# Altium schematic sheet Micro.SchDoc: Microcontrolador MSP430F2618
size A4; Address1: Medidor de energia PROSER; Address2: MEI-300V; DocumentNumber: 2; Revision: 01; SheetNumber: 2; SheetTotal: 6
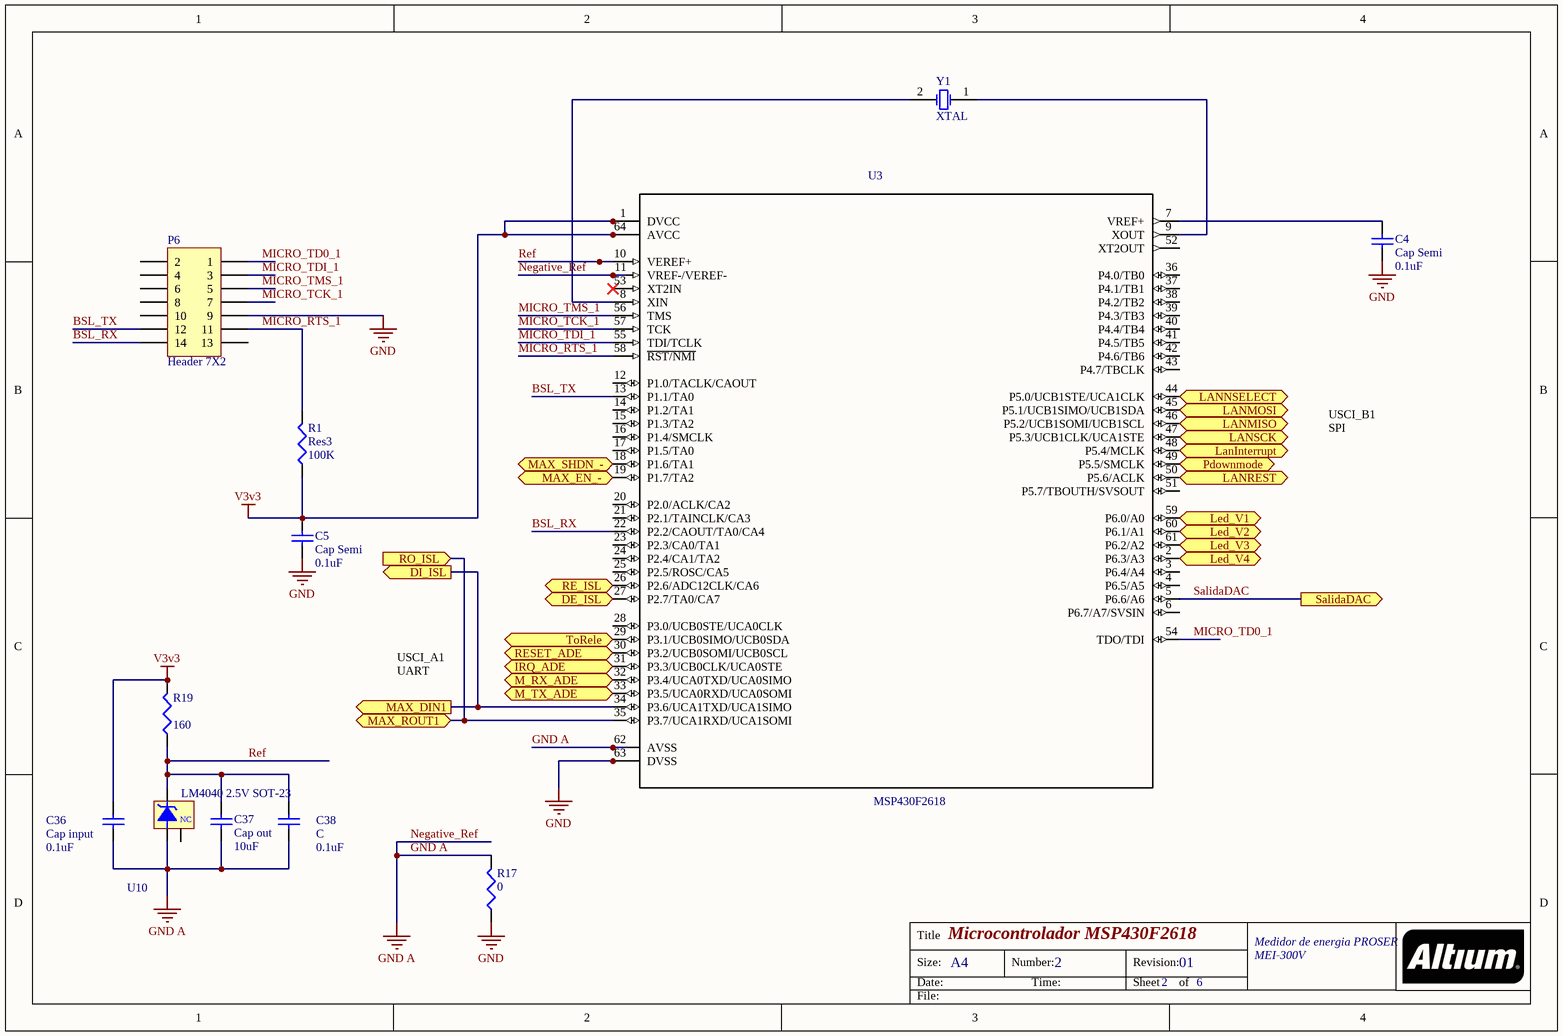
[diagram p0: Micro.SchDoc]

## Parts
C4  Cap Semi  value 0.1uF  [Custom0805]
C5  Cap Semi  value 0.1uF  [Custom0805]
C36  Cap input  value 0.1uF  [CUSTOM0805]
C37  Cap out  value 10uF  [TC6032-2412]
C38  C  value 0.1uF  [Custom0805]
P6  Header 7X2  [HDR2X7]
R1  Res3  value 100K  [Custom0805]
R17  value 0  [Custom0805]  (hidden comment: Res3)
R19  value 160  [Custom0805]  (hidden comment: Res3)
U3  MSP430F2618  [QFP50P1200X1200X160-64N]
U10  LM4040 2.5V SOT-23  [SOT23_M]
Y1  XTAL  [XTAL1140X475X430D1315L440X63M]

## Ports
DE_ISL (out), DI_ISL (out), IRQ_ADE (in), LanInterrupt (in), LANMISO (in), LANMOSI (out), LANNSELECT (out), LANREST (out), LANSCK (out), Led_V1 (out), Led_V2 (out), Led_V3 (out), Led_V4 (out), M_RX_ADE (out), M_TX_ADE (in), MAX_DIN1 (out), MAX_EN_- (out), MAX_ROUT1, MAX_SHDN_- (out), Pdownmode (out), RE_ISL (out), RESET_ADE (out), RO_ISL (in), SalidaDAC (out), ToRele (out)

## Nets
GND: C4.1 C5.1 P6.9 R17.1 U3.63(DVSS)
GND A: C36.1 C37.1 C38.1 R17.2 U3.11(VREF-/VEREF-) U3.62(AVSS) U10.2(A)  [also labelled Negative_Ref]
V3v3: C5.2 C36.2 R1.1 R19.2 U3.1(DVCC) U3.64(AVCC)
BSL_RX: P6.14 U3.22(P2.2/CAOUT/TA0/CA4)
BSL_TX: P6.12 U3.13(P1.1/TA0)
DE_ISL: U3.27(P2.7/TA0/CA7) ; port DE_ISL
DI_ISL: U3.34(P3.6/UCA1TXD/UCA1SIMO) ; port DI_ISL, port MAX_DIN1
IRQ_ADE: U3.31(P3.3/UCB0CLK/UCA0STE) ; port IRQ_ADE
LanInterrupt: U3.48(P5.4/MCLK) ; port LanInterrupt
LANMISO: U3.46(P5.2/UCB1SOMI/UCB1SCL) ; port LANMISO
LANMOSI: U3.45(P5.1/UCB1SIMO/UCB1SDA) ; port LANMOSI
LANNSELECT: U3.44(P5.0/UCB1STE/UCA1CLK) ; port LANNSELECT
LANREST: U3.50(P5.6/ACLK) ; port LANREST
LANSCK: U3.47(P5.3/UCB1CLK/UCA1STE) ; port LANSCK
Led_V1: U3.59(P6.0/A0) ; port Led_V1
Led_V2: U3.60(P6.1/A1) ; port Led_V2
Led_V3: U3.61(P6.2/A2) ; port Led_V3
Led_V4: U3.2(P6.3/A3) ; port Led_V4
M_RX_ADE: U3.32(P3.4/UCA0TXD/UCA0SIMO) ; port M_RX_ADE
M_TX_ADE: U3.33(P3.5/UCA0RXD/UCA0SOMI) ; port M_TX_ADE
MAX_EN_-: U3.19(P1.7/TA2) ; port MAX_EN_-
MAX_ROUT1: U3.35(P3.7/UCA1RXD/UCA1SOMI) ; port RO_ISL, port MAX_ROUT1
MAX_SHDN_-: U3.18(P1.6/TA1) ; port MAX_SHDN_-
MICRO_RTS_1: P6.11 R1.2 U3.58(~{RST/NMI})
MICRO_TCK_1: P6.7 U3.57(TCK)
MICRO_TD0_1: P6.1 U3.54(TDO/TDI)
MICRO_TDI_1: P6.3 U3.55(TDI/TCLK)
MICRO_TMS_1: P6.5 U3.56(TMS)
Pdownmode: U3.49(P5.5/SMCLK) ; port Pdownmode
RE_ISL: U3.26(P2.6/ADC12CLK/CA6) ; port RE_ISL
Ref: C37.2 C38.2 R19.1 U3.10(VEREF+) U10.1(K)
RESET_ADE: U3.30(P3.2/UCB0SOMI/UCB0SCL) ; port RESET_ADE
SalidaDAC: U3.5(P6.6/A6) ; port SalidaDAC
ToRele: U3.29(P3.1/UCB0SIMO/UCB0SDA) ; port ToRele
NetC4_2: C4.2 U3.7(VREF+)
NetU3_8: U3.8(XIN) Y1.2(OSC2)
NetU3_9: U3.9(XOUT) Y1.1(OSC1)

Not connected (* = marked no-connect by the designer): P6 2 4 6 8 10 13; U3 3(P6.4/A4) 4(P6.5/A5) 6(P6.7/A7/SVSIN) 12(P1.0/TACLK/CAOUT) 14(P1.2/TA1) 15(P1.3/TA2) 16(P1.4/SMCLK) 17(P1.5/TA0) 20(P2.0/ACLK/CA2) 21(P2.1/TAINCLK/CA3) 23(P2.3/CA0/TA1) 24(P2.4/CA1/TA2) 25(P2.5/ROSC/CA5) 28(P3.0/UCB0STE/UCA0CLK) 36(P4.0/TB0) 37(P4.1/TB1) 38(P4.2/TB2) 39(P4.3/TB3) 40(P4.4/TB4) 41(P4.5/TB5) 42(P4.6/TB6) 43(P4.7/TBCLK) 51(P5.7/TBOUTH/SVSOUT) 52(XT2OUT) 53(XT2IN)*; U10 3(NC)

## Notes on the sheet
- USCI_B1
  SPI
- USCI_A1
  UART
- Title
- Size:
- Date:
- A4
- Number:
- Time:
- Revision:
- Sheet
- of
- File:

## Library data of the parts
C4 C5 C36-C38 = Cap Semi: Capacitor (Semiconductor SIM Model); Published: 8-Jun-2000; LatestRevisionDate: 29-May-2009; LatestRevisionNote: IPC-7351 Footprint Added.; PackageReference: C1206; Publisher: Altium Limited; PackageDescription: Chip Capacitor
P6 = Header 7X2: Header, 7-Pin, Dual row; LatestRevisionDate: 17-Jul-2002; LatestRevisionNote: Re-released for DXP Platform.; Publisher: Altium Limited
R1 R17 R19 = Res3: Resistor; Published: 8-Jun-2000; LatestRevisionDate: 29-May-2009; LatestRevisionNote: IPC-7351 Footprint Added.; PackageReference: J1-0603; Publisher: Altium Limited; PackageDescription: Chip Resistor
U3 = MSP430F2410TPMR: 16-bit Ultra-Low-Power Microcontroller, 56KB Flash, 4KB RAM, 12-Bit ADC, 2 USCIs, HW Multiplier 64-LQFP -40 to 105; MF: Texas Instruments; Package: LQFP-64 Texas Instruments; Price: None; SnapEDA_Link: https://www.snapeda.com/parts/MSP430F2410TPMR/Texas%20Instruments/view-part/?ref=snap; Availability: Unavailable; MP: MSP430F2410TPMR; Value: *
U10 = LM185LD-2.5: Micropower Voltage Reference; Note: Anode (pin 3) is in electrical contact with the case.; Published: 15-Apr-2002; DatasheetVersion: Jan-1989; PackageVersion: 1989; PackageReference: LD003; Publisher: Altium Limited; PackageDescription: Can; 3 Leads; Pin Circle Dia. 2.54 mm; Lead Dia. 0.48 mm (max); ComponentLink1Description: Manufacturer Link; ComponentLink1URL: http://www.ti.com/
Y1 = XTAL: Crystal Oscillator; Published: 8-Jun-2000; LatestRevisionDate: 17-Jul-2002; LatestRevisionNote: Re-released for DXP Platform.; PackageReference: R38; Publisher: Altium Limited; PackageDescription: Crystal, Thru-Hole; 2 Leads; Body 3.1 x 8.2 mm (Dia.xH)